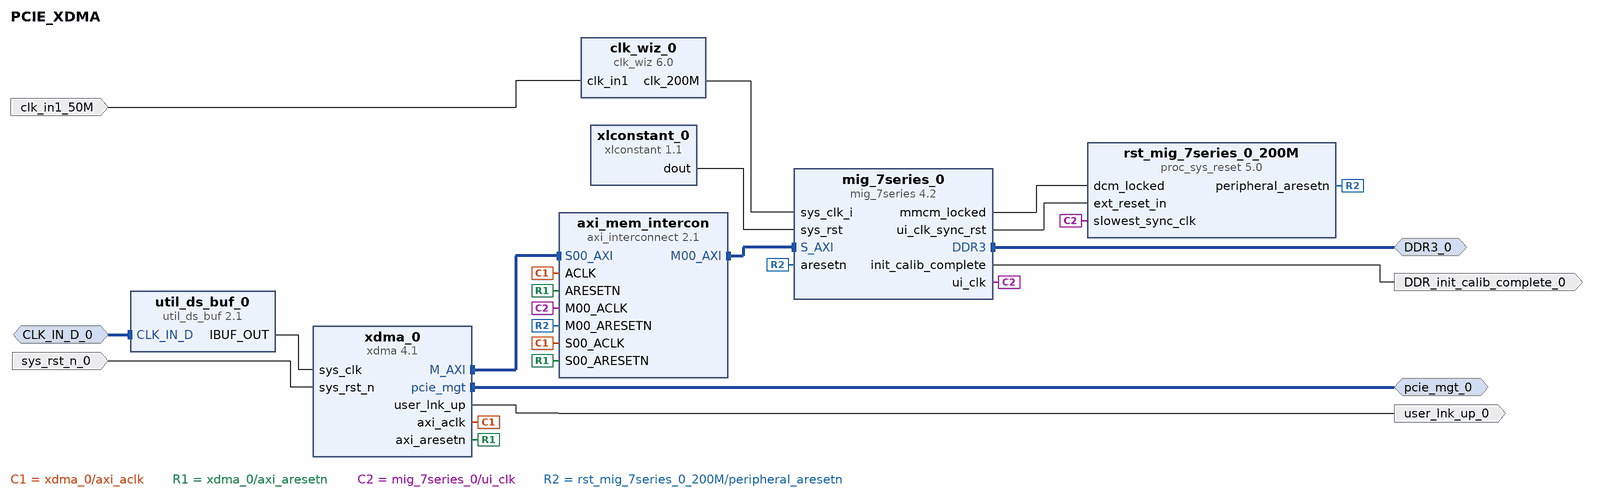
[diagram p0: block diagram of the top level]
# Vivado block design PCIE_XDMA, xc7k325tffg900-2, Vivado 2019.1
create_bd_design PCIE_XDMA

create_bd_intf_port -mode Slave -vlnv xilinx.com:interface:diff_clock_rtl:1.0 CLK_IN_D_0
create_bd_intf_port -mode Master -vlnv xilinx.com:interface:pcie_7x_mgt_rtl:1.0 pcie_mgt_0
create_bd_intf_port -mode Master -vlnv xilinx.com:interface:ddrx_rtl:1.0 DDR3_0
create_bd_port -dir I -type rst sys_rst_n_0
create_bd_port -dir O user_lnk_up_0
create_bd_port -dir I -type clk clk_in1_50M
set_property -dict {CONFIG.FREQ_HZ 50000000} [get_bd_ports clk_in1_50M]
create_bd_port -dir O DDR_init_calib_complete_0

create_bd_cell -type ip -vlnv xilinx.com:ip:util_ds_buf:2.1 util_ds_buf_0
set_property -dict {CONFIG.C_BUF_TYPE IBUFDSGTE} [get_bd_cells util_ds_buf_0]
create_bd_cell -type ip -vlnv xilinx.com:ip:xdma:4.1 xdma_0
set_property -dict [list \
  CONFIG.PF0_DEVICE_ID_mqdma 9028 \
  CONFIG.PF2_DEVICE_ID_mqdma 9028 \
  CONFIG.PF3_DEVICE_ID_mqdma 9028 \
  CONFIG.axi_data_width 128_bit \
  CONFIG.axisten_freq 250 \
  CONFIG.mode_selection Advanced \
  CONFIG.pf0_class_code_base 05 \
  CONFIG.pf0_class_code_interface 00 \
  CONFIG.pf0_class_code_sub 80 \
  CONFIG.pf0_device_id 7024 \
  CONFIG.pf0_sub_class_interface_menu Generic_XT_compatible_serial_controller \
  CONFIG.pl_link_cap_max_link_speed 5.0_GT/s \
  CONFIG.pl_link_cap_max_link_width X8 \
  CONFIG.plltype QPLL1 \
  CONFIG.xdma_rnum_chnl 2 \
  CONFIG.xdma_wnum_chnl 2 \
] [get_bd_cells xdma_0]
create_bd_cell -type ip -vlnv xilinx.com:ip:mig_7series:4.2 mig_7series_0
set_property -dict [list \
  CONFIG.BOARD_MIG_PARAM Custom \
  CONFIG.MIG_DONT_TOUCH_PARAM Custom \
  CONFIG.RESET_BOARD_INTERFACE Custom \
  CONFIG.XML_INPUT_FILE mig_a.prj \
] [get_bd_cells mig_7series_0]
create_bd_cell -type ip -vlnv xilinx.com:ip:clk_wiz:6.0 clk_wiz_0
set_property -dict [list \
  CONFIG.CLKIN1_JITTER_PS 200.0 \
  CONFIG.CLKOUT1_JITTER 142.107 \
  CONFIG.CLKOUT1_PHASE_ERROR 164.985 \
  CONFIG.CLKOUT1_REQUESTED_OUT_FREQ 200.000 \
  CONFIG.CLK_OUT1_PORT clk_200M \
  CONFIG.MMCM_CLKFBOUT_MULT_F 20.000 \
  CONFIG.MMCM_CLKIN1_PERIOD 20.000 \
  CONFIG.MMCM_CLKIN2_PERIOD 10.0 \
  CONFIG.MMCM_CLKOUT0_DIVIDE_F 5.000 \
  CONFIG.PRIM_IN_FREQ 50.000 \
  CONFIG.USE_RESET false \
] [get_bd_cells clk_wiz_0]
create_bd_cell -type ip -vlnv xilinx.com:ip:xlconstant:1.1 xlconstant_0
create_bd_cell -type ip -vlnv xilinx.com:ip:axi_interconnect:2.1 axi_mem_intercon
set_property -dict {CONFIG.NUM_MI 1} [get_bd_cells axi_mem_intercon]
create_bd_cell -type ip -vlnv xilinx.com:ip:proc_sys_reset:5.0 rst_mig_7series_0_200M

# ---- connections ----

connect_bd_intf_net [get_bd_intf_ports DDR3_0] [get_bd_intf_pins mig_7series_0/DDR3]
connect_bd_intf_net -intf_net CLK_IN_D_0_1 [get_bd_intf_ports CLK_IN_D_0] [get_bd_intf_pins util_ds_buf_0/CLK_IN_D]
connect_bd_intf_net [get_bd_intf_ports pcie_mgt_0] [get_bd_intf_pins xdma_0/pcie_mgt]
connect_bd_intf_net [get_bd_intf_pins xdma_0/M_AXI] [get_bd_intf_pins axi_mem_intercon/S00_AXI]
connect_bd_intf_net [get_bd_intf_pins axi_mem_intercon/M00_AXI] [get_bd_intf_pins mig_7series_0/S_AXI]
connect_bd_net [get_bd_pins util_ds_buf_0/IBUF_OUT] [get_bd_pins xdma_0/sys_clk]
connect_bd_net -net sys_rst_n_0_1 [get_bd_ports sys_rst_n_0] [get_bd_pins xdma_0/sys_rst_n]
connect_bd_net [get_bd_pins xdma_0/user_lnk_up] [get_bd_ports user_lnk_up_0]
connect_bd_net -net clk_in1_0_1 [get_bd_ports clk_in1_50M] [get_bd_pins clk_wiz_0/clk_in1]
connect_bd_net [get_bd_pins clk_wiz_0/clk_200M] [get_bd_pins mig_7series_0/sys_clk_i]
connect_bd_net [get_bd_pins xlconstant_0/dout] [get_bd_pins mig_7series_0/sys_rst]
connect_bd_net [get_bd_pins xdma_0/axi_aclk] [get_bd_pins axi_mem_intercon/S00_ACLK] [get_bd_pins axi_mem_intercon/ACLK]
connect_bd_net [get_bd_pins xdma_0/axi_aresetn] [get_bd_pins axi_mem_intercon/S00_ARESETN] [get_bd_pins axi_mem_intercon/ARESETN]
connect_bd_net [get_bd_pins mig_7series_0/ui_clk] [get_bd_pins axi_mem_intercon/M00_ACLK] [get_bd_pins rst_mig_7series_0_200M/slowest_sync_clk]
connect_bd_net [get_bd_pins mig_7series_0/mmcm_locked] [get_bd_pins rst_mig_7series_0_200M/dcm_locked]
connect_bd_net [get_bd_pins mig_7series_0/ui_clk_sync_rst] [get_bd_pins rst_mig_7series_0_200M/ext_reset_in]
connect_bd_net [get_bd_pins rst_mig_7series_0_200M/peripheral_aresetn] [get_bd_pins mig_7series_0/aresetn] [get_bd_pins axi_mem_intercon/M00_ARESETN]
connect_bd_net [get_bd_pins mig_7series_0/init_calib_complete] [get_bd_ports DDR_init_calib_complete_0]

# ---- address map ----
assign_bd_address -offset 0x0000000000000000 -range 4G -target_address_space [get_bd_addr_spaces xdma_0/M_AXI] [get_bd_addr_segs mig_7series_0/memmap/memaddr]

validate_bd_design
save_bd_design
